# Altium schematic sheet pidbot.SchDoc
size 420 x 297 mm
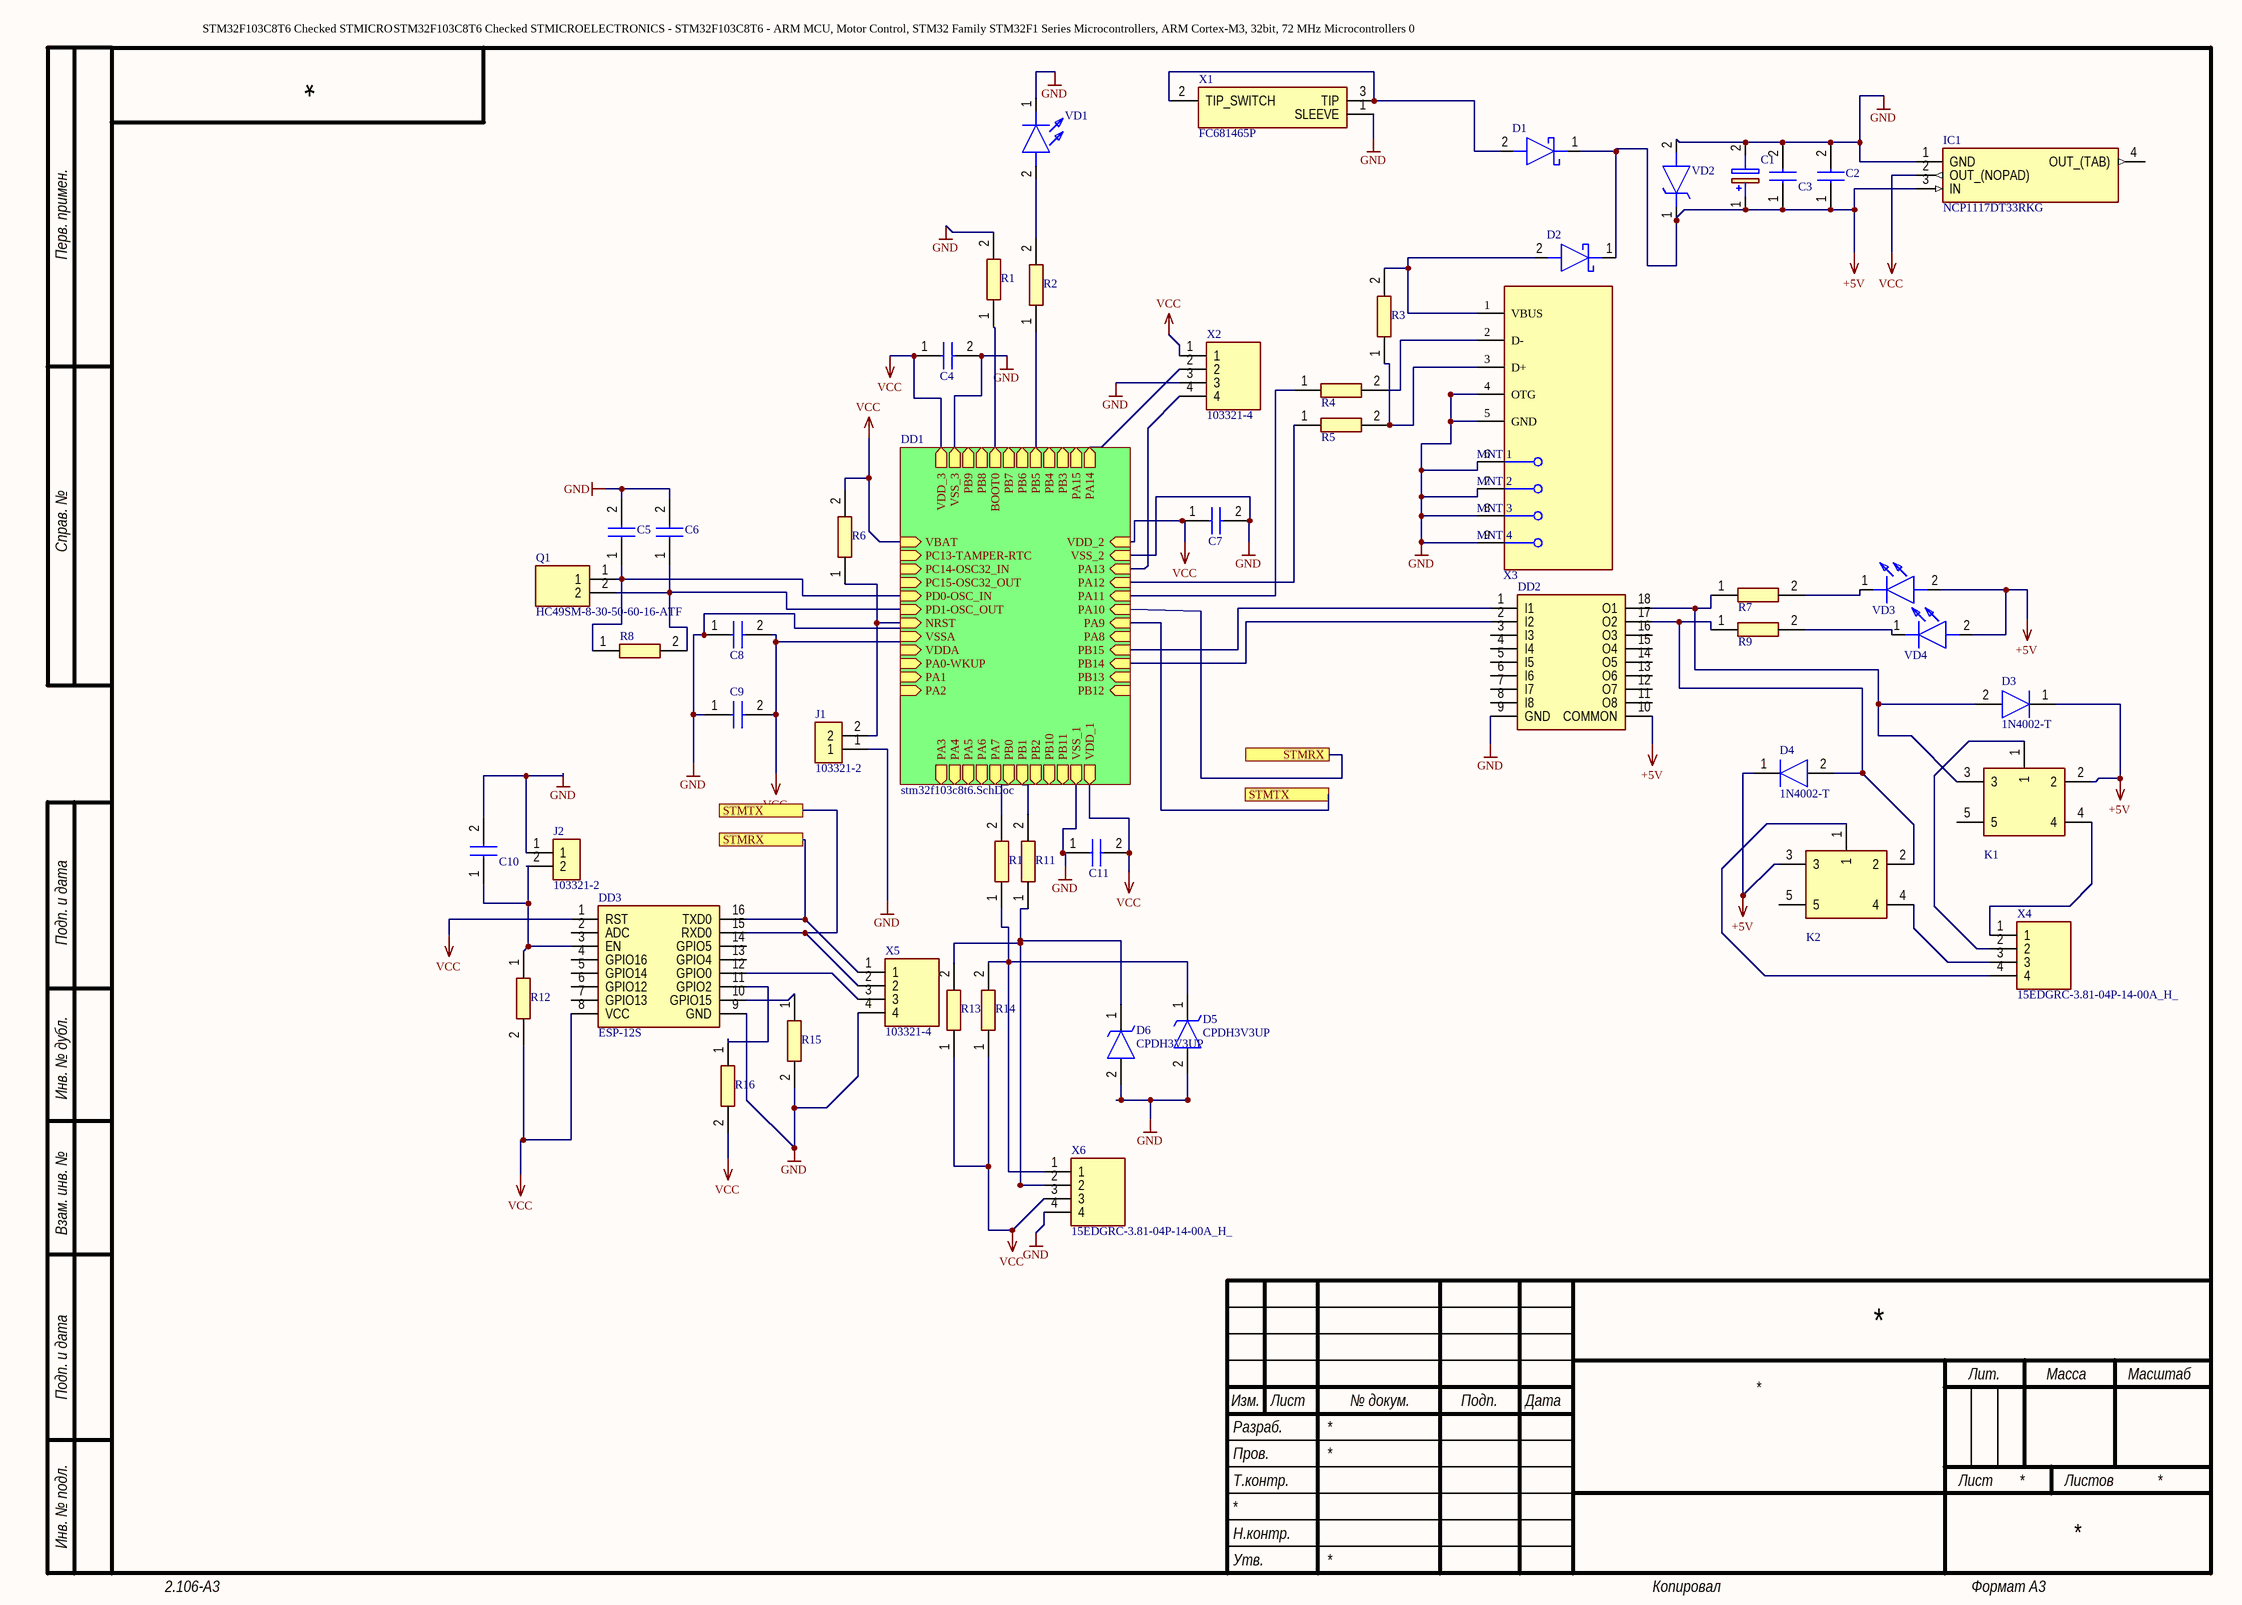
[diagram p0: pidbot.SchDoc]

## Parts
C1  470uF(CPOL)  [CAPAE530X610N]  (value not drawn)
C2  10uF(0805)  [CAPC2012X145N]  (value not drawn)
C3  0.1uF(0603)  [CAPC1608X90N]  (value not drawn)
C4  0.1uF(0603)  [CAPC1608X90N]  (value not drawn)
C5  27pF(0603)  [CAPC1608X90N]  (value not drawn)
C6  27pF(0603)  [CAPC1608X90N]  (value not drawn)
C7  0.1uF(0603)  [CAPC1608X90N]  (value not drawn)
C8  0.1uF(0603)  [CAPC1608X90N]  (value not drawn)
C9  10uF(0805)  [CAPC2012X145N]  (value not drawn)
C10  10uF(0805)  [CAPC2012X145N]  (value not drawn)
C11  0.1uF(0603)  [CAPC1608X90N]  (value not drawn)
D1  SS14FL  [SODFL3617X108N]  (value not drawn)
D2  SS14FL  [SODFL3617X108N]  (value not drawn)
D3  1N4002-T  [DIOAD1408W86L464D236]
D4  1N4002-T  [DIOAD1408W86L464D236]
D5  CPDH3V3UP  [CPDH3V3UP]
D6  CPDH3V3UP  [CPDH3V3UP]
DD2  ULN2803AFWG,C,EL  [SOIC127P1032X285-18N]  (value not drawn)
DD3  ESP-12S  [ESP12S]
IC1  NCP1117DT33RKG  [TO229P990X238-4N]
J1  103321-2  [HDRV4W66P0X254_1X2_975X234X1036P]
J2  103321-2  [HDRV4W66P0X254_1X2_975X234X1036P]
K1  SRD-05VDC-SL-C  [SRD]  (value not drawn)
K2  SRD-05VDC-SL-C  [SRD]  (value not drawn)
Q1  HC49SM-8-30-50-60-16-ATF  [HC49SM830506016ATF]
R1  10K(0603)  [RESC1608X50N]  (value not drawn)
R2  330(0603)  [RESC1608X50N]  (value not drawn)
R3  1500(0603)  [RESC1608X50N]  (value not drawn)
R4  22(0603)  [RESC1608X50N]  (value not drawn)
R5  22(0603)  [RESC1608X50N]  (value not drawn)
R6  10K(0603)  [RESC1608X50N]  (value not drawn)
R7  470(0603)  [RESC1608X50N]  (value not drawn)
R8  1M(0603)  [RESC1608X50N]  (value not drawn)
R9  470(0603)  [RESC1608X50N]  (value not drawn)
R10  10(0603)  [RESC1608X50N]  (value not drawn)
R11  10(0603)  [RESC1608X50N]  (value not drawn)
R12  1K(0603)  [RESC1608X50N]  (value not drawn)
R13  10K(0603)  [RESC1608X50N]  (value not drawn)
R14  10K(0603)  [RESC1608X50N]  (value not drawn)
R15  1K(0603)  [RESC1608X50N]  (value not drawn)
R16  1K(0603)  [RESC1608X50N]  (value not drawn)
VD1  KP-2012SGC  [LEDC2012X110N]  (value not drawn)
VD2  1N4733AUR  [DO-213AB]  (value not drawn)
VD3  KP-2012SGC  [LEDC2012X110N]  (value not drawn)
VD4  KP-2012SGC  [LEDC2012X110N]  (value not drawn)
X1  FC681465P  [FC681465P]
X2  103321-4  [HDRV4W66P0X254_1X4_975X234X1036P]
X3  *  [Wurth_0_MFG]  (value not drawn)
X4  15EDGRC-3.81-04P-14-00A_H_  [SHDRRA4W80P0X381_1X4_1603X920X754P]
X5  103321-4  [HDRV4W66P0X254_1X4_975X234X1036P]
X6  15EDGRC-3.81-04P-14-00A_H_  [SHDRRA4W80P0X381_1X4_1603X920X754P]

## Sub-sheets
DD1 = stm32f103c8t6.SchDoc: VBAT, PC13-TAMPER-RTC, PC14-OSC32_IN, PC15-OSC32_OUT, PD0-OSC_IN, PD1-OSC_OUT, NRST, VSSA, VDDA, PA0-WKUP, PA1, PA2, PA3, PA4, PA5, PA6, PA7, PB0, PB1, PB2, PB10, PB11, VSS_1, VDD_1, VDD_2, VSS_2, PA13, PA12, PA11, PA10, PA9, PA8, PB15, PB14, PB13, PB12, VDD_3, VSS_3, PB9, PB8, BOOT0, PB7, PB6, PB5, PB4, PB3, PA15, PA14

## Ports
STMRX, STMTX

## Nets
+5V: C1.1(+) C2.1 C3.1 D1.1(K) D2.1(K) D3.1(K) D4.1(K) DD2.10(COMMON) IC1.3(IN) K1.2 K2.3 VD2.1(K) VD3.2(A) VD4.2(A)
GND: C1.2(-) C2.2 C3.2 C4.2 C5.2 C6.2 C7.2 C8.1 C9.1 C10.2 C11.1 D5.2(A) D6.2(A) DD2.9(GND) DD3.9(GND) IC1.1(GND) J1.1 J2.1 R1.2 R15.2 VD1.1(K) VD2.2(A) X1.1(SLEEVE) X2.3 X3.4(OTG) X3.5(GND) X3.6(MNT_1) X3.7(MNT_2) X3.8(MNT_3) X3.9(MNT_4) X5.4 X6.4 ; sheet DD1/VSSA, sheet DD1/VSS_1, sheet DD1/VSS_2, sheet DD1/VSS_3
VCC: C4.1 C7.1 C8.2 C9.2 C11.2 DD3.1(RST) DD3.8(VCC) IC1.2(OUT_(NOPAD)) R6.2 R12.2 R13.1 R14.1 R16.2 X2.1 X6.3 ; sheet DD1/VBAT, sheet DD1/VDDA, sheet DD1/VDD_1, sheet DD1/VDD_2, sheet DD1/VDD_3
STMRX: DD3.16(TXD0) X5.1 ; port STMRX, sheet DD1/PA10
STMTX: DD3.15(RXD0) X5.2 ; port STMTX, sheet DD1/PA9
NetC5_1: C5.1 Q1.1 R8.1 ; sheet DD1/PD0-OSC_IN
NetC6_1: C6.1 Q1.2 R8.2 ; sheet DD1/PD1-OSC_OUT
NetC10_1: C10.1 DD3.3(EN) J2.2 R12.1
NetD1_2: D1.2(A) X1.2(TIP_SWITCH) X1.3(TIP)
NetD2_2: D2.2(A) R3.2 X3.1(VBUS)
NetD3_2: D3.2(A) DD2.18(O1) K1.3 R7.1
NetD4_2: D4.2(A) DD2.17(O2) K2.2 R9.1
NetD5_1: D5.1(K) R10.1 R14.2 X6.1
NetD6_1: D6.1(K) R11.1 R13.2 X6.2
NetDD2_1: DD2.1(I1) ; sheet DD1/PB15
NetDD2_2: DD2.2(I2) ; sheet DD1/PB14
NetDD3_10: DD3.10(GPIO15) R15.1
NetDD3_11: DD3.11(GPIO2) R16.1
NetDD3_12: DD3.12(GPIO0) X5.3
NetJ1_2: J1.2 R6.1 ; sheet DD1/NRST
NetK1_1: K1.1 X4.2
NetK1_4: K1.4 X4.1
NetK2_1: K2.1 X4.4
NetK2_4: K2.4 X4.3
NetR1_1: R1.1 ; sheet DD1/BOOT0
NetR2_1: R2.1 ; sheet DD1/PB5
NetR2_2: R2.2 VD1.2(A)
NetR3_1: R3.1 R5.2 X3.3(D+)
NetR4_1: R4.1 ; sheet DD1/PA11
NetR4_2: R4.2 X3.2(D-)
NetR5_1: R5.1 ; sheet DD1/PA12
NetR7_2: R7.2 VD3.1(K)
NetR9_2: R9.2 VD4.1(K)
NetR10_2: R10.2 ; sheet DD1/PB0
NetR11_2: R11.2 ; sheet DD1/PB1
NetX2_2: X2.2 ; sheet DD1/PA14
NetX2_4: X2.4 ; sheet DD1/PA13

Not connected (* = marked no-connect by the designer): DD2 3(I3) 4(I4) 5(I5) 6(I6) 7(I7) 8(I8) 11(O8) 12(O7) 13(O6) 14(O5) 15(O4) 16(O3); DD3 2(ADC) 4(GPIO16) 5(GPIO14) 6(GPIO12) 7(GPIO13) 13(GPIO4) 14(GPIO5); IC1 4(OUT_(TAB)); K1 5; K2 5

## Notes on the sheet
- STM32F103C8T6	Checked	STMICROELECTRONICS - STM32F103C8T6 - ARM MCU, Motor Control, STM32 Family STM32F1 Series Microcontrollers, ARM Cortex-M3, 32bit, 72 MHz	Microcontrollers	0
- Перв. примен.
- Справ. №
- Подп. и дата
- Инв. № дубл.
- Взам. инв. №
- Разраб.
- Изм.
- Лист
- № докум.
- Подп.
- Дата
- Лит.
- Масса
- Масштаб
- Пров.
- Т.контр.
- Листов
- Инв. № подл.
- Утв.
- Н.контр.
- 2.106-A3
- Копировал
- Формат А3

## Library data of the parts
C1 = EEEFK0J470R: Capacitor Polarised; Manufacturer_Name: Panasonic; Datasheet Link: https://industrial.panasonic.com/cdbs/www-data/pdf/RDE0000/ABA0000C1181.pdf; Height: 6.1mm; Manufacturer_Part_Number: EEEFK0J470R
C2 C9 C10 = C2012X6S1A106K125AB: Capacitor; Manufacturer_Name: TDK; Datasheet Link: https://product.tdk.com/info/en/catalog/datasheets/mlcc_commercial_midvoltage_en.pdf; Height: 1.45mm; Manufacturer_Part_Number: C2012X6S1A106K125AB; Mouser Part Number: 810-C2012X6S1A106K1B; Mouser Price/Stock: https://www.mouser.com/Search/Refine.aspx?Keyword=810-C2012X6S1A106K1B
C3-C8 C11 = 06035A270FAT2A: Capacitor; Manufacturer_Name: AVX; Datasheet Link: https://componentsearchengine.com/Datasheets/1/06031A100FAT2A.pdf; Height: 0.9mm; Manufacturer_Part_Number: 06035A270FAT2A; Mouser Part Number: 581-06035A270FAT2A; Mouser Price/Stock: http://www.mouser.com/Search/ProductDetail.aspx?qs=pLllxMKqYOUE57iRl783tA%3d%3d
D1 D2 = SS14FL: Schottky Diode; Manufacturer_Name: ON Semiconductor; Datasheet Link: http://www.onsemi.com/pub/Collateral/SS14FL-D.PDF; Height: 1.08mm; Manufacturer_Part_Number: SS14FL; Mouser Part Number: 512-SS14FL; Mouser Price/Stock: https://www.mouser.co.uk/ProductDetail/ON-Semiconductor-Fairchild/SS14FL?qs=tqW9UTzndZz8XxVZxr%252BlfQ%3D%3D; Arrow Part Number: SS14FL; Arrow Price/Stock: https://www.arrow.com/en/products/ss14fl/on-semiconductor
D3 D4 = 1N4002-T: Diode; Manufacturer_Name: Diodes Inc.; Datasheet Link: http://www.diodes.com/_files/datasheets/ds28002.pdf; Manufacturer_Part_Number: 1N4002-T; Mouser Part Number: 621-1N4002-T; Mouser Price/Stock: https://www.mouser.co.uk/ProductDetail/Diodes-Incorporated/1N4002-T/?qs=rGAXPo9uwV21tVJRR%252BhxrQ%3D%3D; Arrow Part Number: 1N4002-T; Arrow Price/Stock: https://www.arrow.com/en/products/1n4002-t/diodes-incorporated
D5 D6 = CPDH3V3UP: TVS Diode (Uni-directional); Manufacturer_Name: Comchip Technology; Datasheet Link: http://www.comchiptech.com/admin/files/product/CPDH3V3UP-HF%20RevB034941.pdf; Height: 0.77mm; Manufacturer_Part_Number: CPDH3V3UP; Mouser Part Number: 750-CPDH3V3UP; Mouser Price/Stock: https://www.mouser.co.uk/ProductDetail/Comchip-Technology/CPDH3V3UP?qs=tw%252BuQ%2FB6PO1cIMMFw61gpA%3D%3D; Arrow Part Number: CPDH3V3UP; Arrow Price/Stock: https://www.arrow.com/en/products/cpdh3v3up/comchip-technology
DD2 = ULN2803AFWG,C,EL: Integrated Circuit; Manufacturer_Name: Toshiba; Datasheet Link: http://toshiba.semicon-storage.com/info/docget.jsp?did=7064&prodName=ULN2803AFWG; Height: 2.85mm; Manufacturer_Part_Number: ULN2803AFWG,C,EL; Mouser Part Number: N/A; Mouser Price/Stock: https://www.mouser.co.uk/ProductDetail/Toshiba/ULN2803AFWGCEL?qs=vPP9GyyTAo2p%2FYO7mXoxbQ%3D%3D; Arrow Part Number: ULN2803AFWG,C,EL; Arrow Price/Stock: https://www.arrow.com/en/products/uln2803afwgcel/toshiba
DD3 = ESP-12S: Integrated Circuit; Manufacturer_Name: RF SOLUTIONS; Datasheet Link: https://www.rfsolutions.co.uk/downloads/1594041895DS-ESP-12S-1.pdf; Height: 3mm; Manufacturer_Part_Number: ESP-12S; Mouser Part Number: 223-ESP-12S; Mouser Price/Stock: https://www.mouser.co.uk/ProductDetail/RF-Solutions/ESP-12S/?qs=UkDUCjYnTB27YArJ5wHUxg%3D%3D
IC1 = NCP1117DT33RKG: Integrated Circuit; Manufacturer_Name: ON Semiconductor; Datasheet Link: http://www.onsemi.com/pub/Collateral/NCP1117-D.PDF; Height: 2.38mm; Manufacturer_Part_Number: NCP1117DT33RKG; Mouser Part Number: 863-NCP1117DT33RKG; Mouser Price/Stock: https://www.mouser.co.uk/ProductDetail/ON-Semiconductor/NCP1117DT33RKG/?qs=Gev%252BmEvV0ibOCOlPKZVI0Q%3D%3D; Arrow Part Number: NCP1117DT33RKG; Arrow Price/Stock: https://www.arrow.com/en/products/ncp1117dt33rkg/on-semiconductor
J1 J2 = 103321-2: Connector; Manufacturer_Name: TE Connectivity; Manufacturer_Part_Number: 103321-4; Datasheet Link: https://www.mouser.com/datasheet/2/418/NG_CD_103321_R_baseFilename-1229694.pdf; Height: 10.363mm; Mouser Part Number: 571-1033214; Mouser Price/Stock: https://www.mouser.co.uk/ProductDetail/TE-Connectivity-AMP/103321-4?qs=HSGlLeu24BNC%2F8%2Fb5G2HmQ%3D%3D; Arrow Part Number: 103321-4; Arrow Price/Stock: https://www.arrow.com/en/products/103321-4/te-connectivity
K1 K2 = SRD-05VDC-SL-C: Relay or Contactor; Manufacturer_Name: Songle Relay; Datasheet Link: http://files.microjpm.webnode.com/200001010-dda41de9e1/Songle%20Relay%20Datasheet.pdf; Manufacturer_Part_Number: SRD-05VDC-SL-C
Q1 = HC49SM-8-30-50-60-16-ATF: Crystal or Oscillator; Manufacturer_Name: MULTICOMP; Datasheet Link: http://www.farnell.com/datasheets/1661828.pdf; Height: 4mm; Manufacturer_Part_Number: HC49SM-8-30-50-60-16-ATF
R1-R16 = CRCW06031M10FKEA: Resistor; Manufacturer_Name: Vishay; Datasheet Link: http://www.vishay.com/docs/20035/dcrcwe3.pdf; Height: 0.5mm; Manufacturer_Part_Number: CRCW06031M10FKEA; Mouser Part Number: 71-CRCW06031M10FKEA; Mouser Price/Stock: https://www.mouser.co.uk/ProductDetail/Vishay-Dale/CRCW06031M10FKEA?qs=dFaIlcvhQOTbdXNp0izuyw%3D%3D; Arrow Part Number: CRCW06031M10FKEA; Arrow Price/Stock: https://www.arrow.com/en/products/crcw06031m10fkea/vishay
VD1 VD3 VD4 = KP-2012SGC: LED; Manufacturer_Name: Kingbright; Datasheet Link: http://my.rs-online.com/webdocs/032f/0900766b8032fa8b.pdf; Height: 1.1mm; Manufacturer_Part_Number: KP-2012SGC; Mouser Part Number: N/A; Mouser Price/Stock: https://www.mouser.co.uk/ProductDetail/Kingbright/KP-2012SGC?qs=2JU0tDl2GZ0tniaU1HaSiA%3D%3D; Arrow Part Number: KP-2012SGC; Arrow Price/Stock: https://www.arrow.com/en/products/kp-2012sgc/kingbright
VD2 = 1N4733AUR: Zener Diode; Manufacturer_Name: Microsemi Corporation; Datasheet Link: https://www.microsemi.com/document-portal/doc_download/11016-sd12a-datasheet; Manufacturer_Part_Number: 1N4733AUR; Mouser Part Number: 494-1N4733AUR; Mouser Price/Stock: https://www.mouser.com/Search/Refine.aspx?Keyword=494-1N4733AUR
X1 = FC681465P: Connector; Manufacturer_Name: CLIFF ELECTRONIC COMPONENTS; Datasheet Link: http://www.farnell.com/datasheets/2286781.pdf; Height: 11mm; Manufacturer_Part_Number: FC681465P
X2 X5 = 103321-4: Connector; Manufacturer_Name: TE Connectivity; Datasheet Link: https://www.mouser.com/datasheet/2/418/NG_CD_103321_R_baseFilename-1229694.pdf; Height: 10.363mm; Manufacturer_Part_Number: 103321-4; Mouser Part Number: 571-1033214; Mouser Price/Stock: https://www.mouser.co.uk/ProductDetail/TE-Connectivity-AMP/103321-4?qs=HSGlLeu24BNC%2F8%2Fb5G2HmQ%3D%3D; Arrow Part Number: 103321-4; Arrow Price/Stock: https://www.arrow.com/en/products/103321-4/te-connectivity
X3 = 629105150521
X4 X6 = 15EDGRC-3.81-04P-14-00A_H_: Connector; Manufacturer_Name: Degson; Manufacturer_Part_Number: 15EDGRC-3.81-04P-14-00A(H); Datasheet Link: https://datasheet.octopart.com/15EDGRC-3.81-04P-14-00A%28H%29-Degson-datasheet-17801160.pdf; Height: 7.54mm